# Altium schematic sheet wwdt.SchDoc: WWDT
size Letter; SheetNumber: 14; SheetTotal: 22
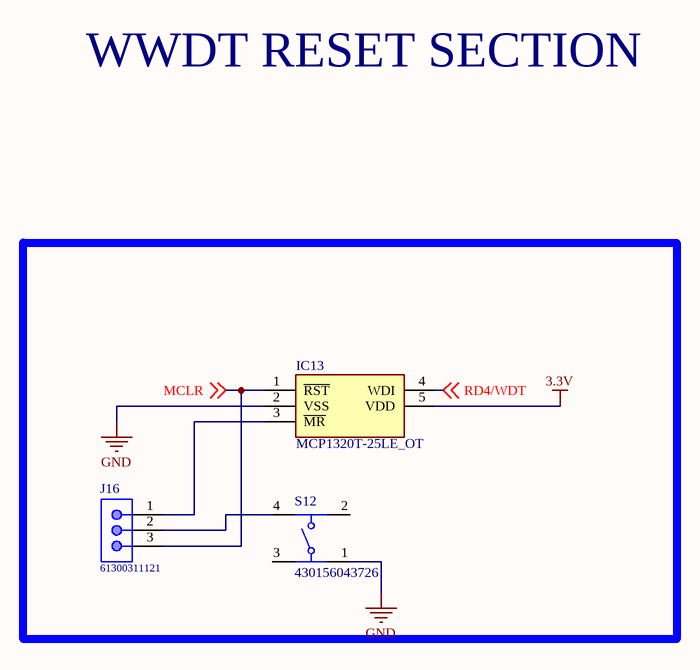
[diagram p0: wwdt.SchDoc]

## Parts
IC13  MCP1320T-25LE_OT  [SOT95P270X145-5N]
J16  61300311121  [61300311121]
S12  430156043726  [4301x60437x6]

## Nets
3.3V: IC13.5(VDD)
GND: IC13.2(VSS) S12.1
MCLR: IC13.1(~{RST}) J16.3 ; off-sheet MCLR
RD4/WDT: IC13.4(WDI) ; off-sheet RD4/WDT
NetIC13_3: IC13.3(~{MR}) J16.1
NetJ16_2: J16.2 S12.4

Not connected (* = marked no-connect by the designer): S12 2 3

## Notes on the sheet
- WWDT RESET SECTION

## Library data of the parts
IC13 = MCP1320T-25LE_OT: Integrated Circuit; Manufacturer_Name: Microchip; Manufacturer_Part_Number: MCP1320T-25LE/OT; Datasheet Link: https://www.arrow.com/en/products/mcp1320t-25leot/microchip-technology; Height: 1.45mm; Mouser Part Number: 579-MCP1320T-25LE/OT; Mouser Price/Stock: https://www.mouser.co.uk/ProductDetail/Microchip-Technology-Atmel/MCP1320T-25LE-OT?qs=Cv1v43EOJpq3RWxPEZurKg%3D%3D; Arrow Part Number: MCP1320T-25LE/OT; Arrow Price/Stock: https://www.arrow.com/en/products/mcp1320t-25leot/microchip-technology?region=nac
J16 = 61300311121: WR-PHD Pin Header, THT, pitch 2.54mm, Single Row, Vertical, 3pin; Pin Number: 3; Gender: Male; Rated Current: 3A; Working Voltage: 250VAC; Withstanding Voltage: 500VAC; Contact Resistance: 20mOhm; ComponentLink1Description: Manufacturer; ComponentLink1URL: http://www.we-online.de; ComponentLink2Description: Datasheet; ComponentLink2URL: https://katalog.we-online.de/em/datasheet/6130xx11121.pdf; Part Number: 61300311121; Published Date: June 2019; Publisher: Wurth Elektronik; Pitch: 2.54mm; Operating Temperature: -40 to +105degC; Mounting Technology: THT; Packaging: Bag; Row Number: Single; Orientation: Vertical
S12 = 430156043726: WS-TATV THT Tact Switch 6x6mm, height 4.3mm, 260gf; Rated Voltage: 12VDC; Rated Current: 50mA; Washable: No; ComponentLink1Description: Manufacturer; ComponentLink1URL: http://www.we-online.de; ComponentLink2Description: Datasheet; ComponentLink2URL: https://katalog.we-online.com/em/datasheet/430156043726.pdf; Operating Temperature: -40 to +85degC; Part Number: 430156043726; Published Date: September 2019; Contact Material: Stainless Steel; Height: 4.3mm; Mounting Technology: THT; Contact Plating: Silver; Operation Force: 260gf; Packaging: Bulk; Terminal Material: Copper Alloy; Publisher: Wurth Elektronik; Terminal Plating: Silver